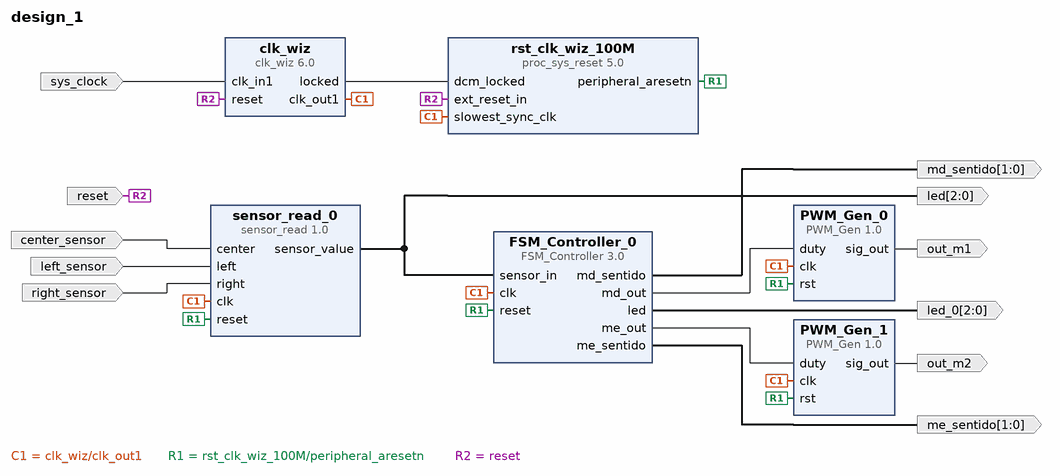
[diagram p0: block diagram of the top level]
# Vivado block design design_1, xc7a35tcpg236-1, Vivado 2018.1
create_bd_design design_1

create_bd_port -dir I center_sensor
create_bd_port -dir I left_sensor
create_bd_port -dir I right_sensor
create_bd_port -dir O out_m1
create_bd_port -dir O out_m2
create_bd_port -dir I -type clk sys_clock
set_property -dict {CONFIG.FREQ_HZ 100000000 CONFIG.PHASE 0.000} [get_bd_ports sys_clock]
create_bd_port -dir I -type rst reset
set_property -dict {CONFIG.POLARITY ACTIVE_HIGH} [get_bd_ports reset]
create_bd_port -dir O -from 2 -to 0 led
create_bd_port -dir O -from 1 -to 0 md_sentido
create_bd_port -dir O -from 1 -to 0 me_sentido
create_bd_port -dir O -from 2 -to 0 led_0

create_bd_cell -type ip -vlnv unb_fga:line_follower:sensor_read:1.0 sensor_read_0
create_bd_cell -type ip -vlnv xilinx.com:ip:clk_wiz:6.0 clk_wiz
set_property -dict [list \
  CONFIG.USE_BOARD_FLOW true \
  CONFIG.CLK_IN1_BOARD_INTERFACE sys_clock \
  CONFIG.RESET_BOARD_INTERFACE reset \
] [get_bd_cells clk_wiz]
create_bd_cell -type ip -vlnv xilinx.com:ip:proc_sys_reset:5.0 rst_clk_wiz_100M
set_property -dict {CONFIG.USE_BOARD_FLOW true CONFIG.RESET_BOARD_INTERFACE reset} [get_bd_cells rst_clk_wiz_100M]
create_bd_cell -type ip -vlnv unb_fga:line_follower:PWM_Gen:1.0 PWM_Gen_0
create_bd_cell -type ip -vlnv unb_fga:line_follower:PWM_Gen:1.0 PWM_Gen_1
create_bd_cell -type ip -vlnv UnB_FGA:line_follower:FSM_Controller:3.0 FSM_Controller_0

# ---- connections ----

connect_bd_net [get_bd_pins clk_wiz/clk_out1] \
  [get_bd_pins sensor_read_0/clk] [get_bd_pins rst_clk_wiz_100M/slowest_sync_clk] [get_bd_pins PWM_Gen_0/clk] \
  [get_bd_pins PWM_Gen_1/clk] [get_bd_pins FSM_Controller_0/clk]
connect_bd_net [get_bd_pins clk_wiz/locked] [get_bd_pins rst_clk_wiz_100M/dcm_locked]
connect_bd_net [get_bd_pins rst_clk_wiz_100M/peripheral_aresetn] \
  [get_bd_pins sensor_read_0/reset] [get_bd_pins PWM_Gen_1/rst] [get_bd_pins PWM_Gen_0/rst] \
  [get_bd_pins FSM_Controller_0/reset]
connect_bd_net -net center_0_1 [get_bd_ports center_sensor] [get_bd_pins sensor_read_0/center]
connect_bd_net -net left_0_1 [get_bd_ports left_sensor] [get_bd_pins sensor_read_0/left]
connect_bd_net -net right_0_1 [get_bd_ports right_sensor] [get_bd_pins sensor_read_0/right]
connect_bd_net [get_bd_pins PWM_Gen_0/sig_out] [get_bd_ports out_m1]
connect_bd_net [get_bd_pins PWM_Gen_1/sig_out] [get_bd_ports out_m2]
connect_bd_net [get_bd_ports sys_clock] [get_bd_pins clk_wiz/clk_in1]
connect_bd_net [get_bd_ports reset] [get_bd_pins clk_wiz/reset] [get_bd_pins rst_clk_wiz_100M/ext_reset_in]
connect_bd_net [get_bd_pins sensor_read_0/sensor_value] [get_bd_pins FSM_Controller_0/sensor_in] [get_bd_ports led]
connect_bd_net [get_bd_pins FSM_Controller_0/md_out] [get_bd_pins PWM_Gen_0/duty]
connect_bd_net [get_bd_pins FSM_Controller_0/me_out] [get_bd_pins PWM_Gen_1/duty]
connect_bd_net [get_bd_pins FSM_Controller_0/md_sentido] [get_bd_ports md_sentido]
connect_bd_net [get_bd_pins FSM_Controller_0/me_sentido] [get_bd_ports me_sentido]
connect_bd_net [get_bd_pins FSM_Controller_0/led] [get_bd_ports led_0]

validate_bd_design
save_bd_design
